# EAGLE design USBSocket_Type3_v1.0 (EAGLE 9.6.2)
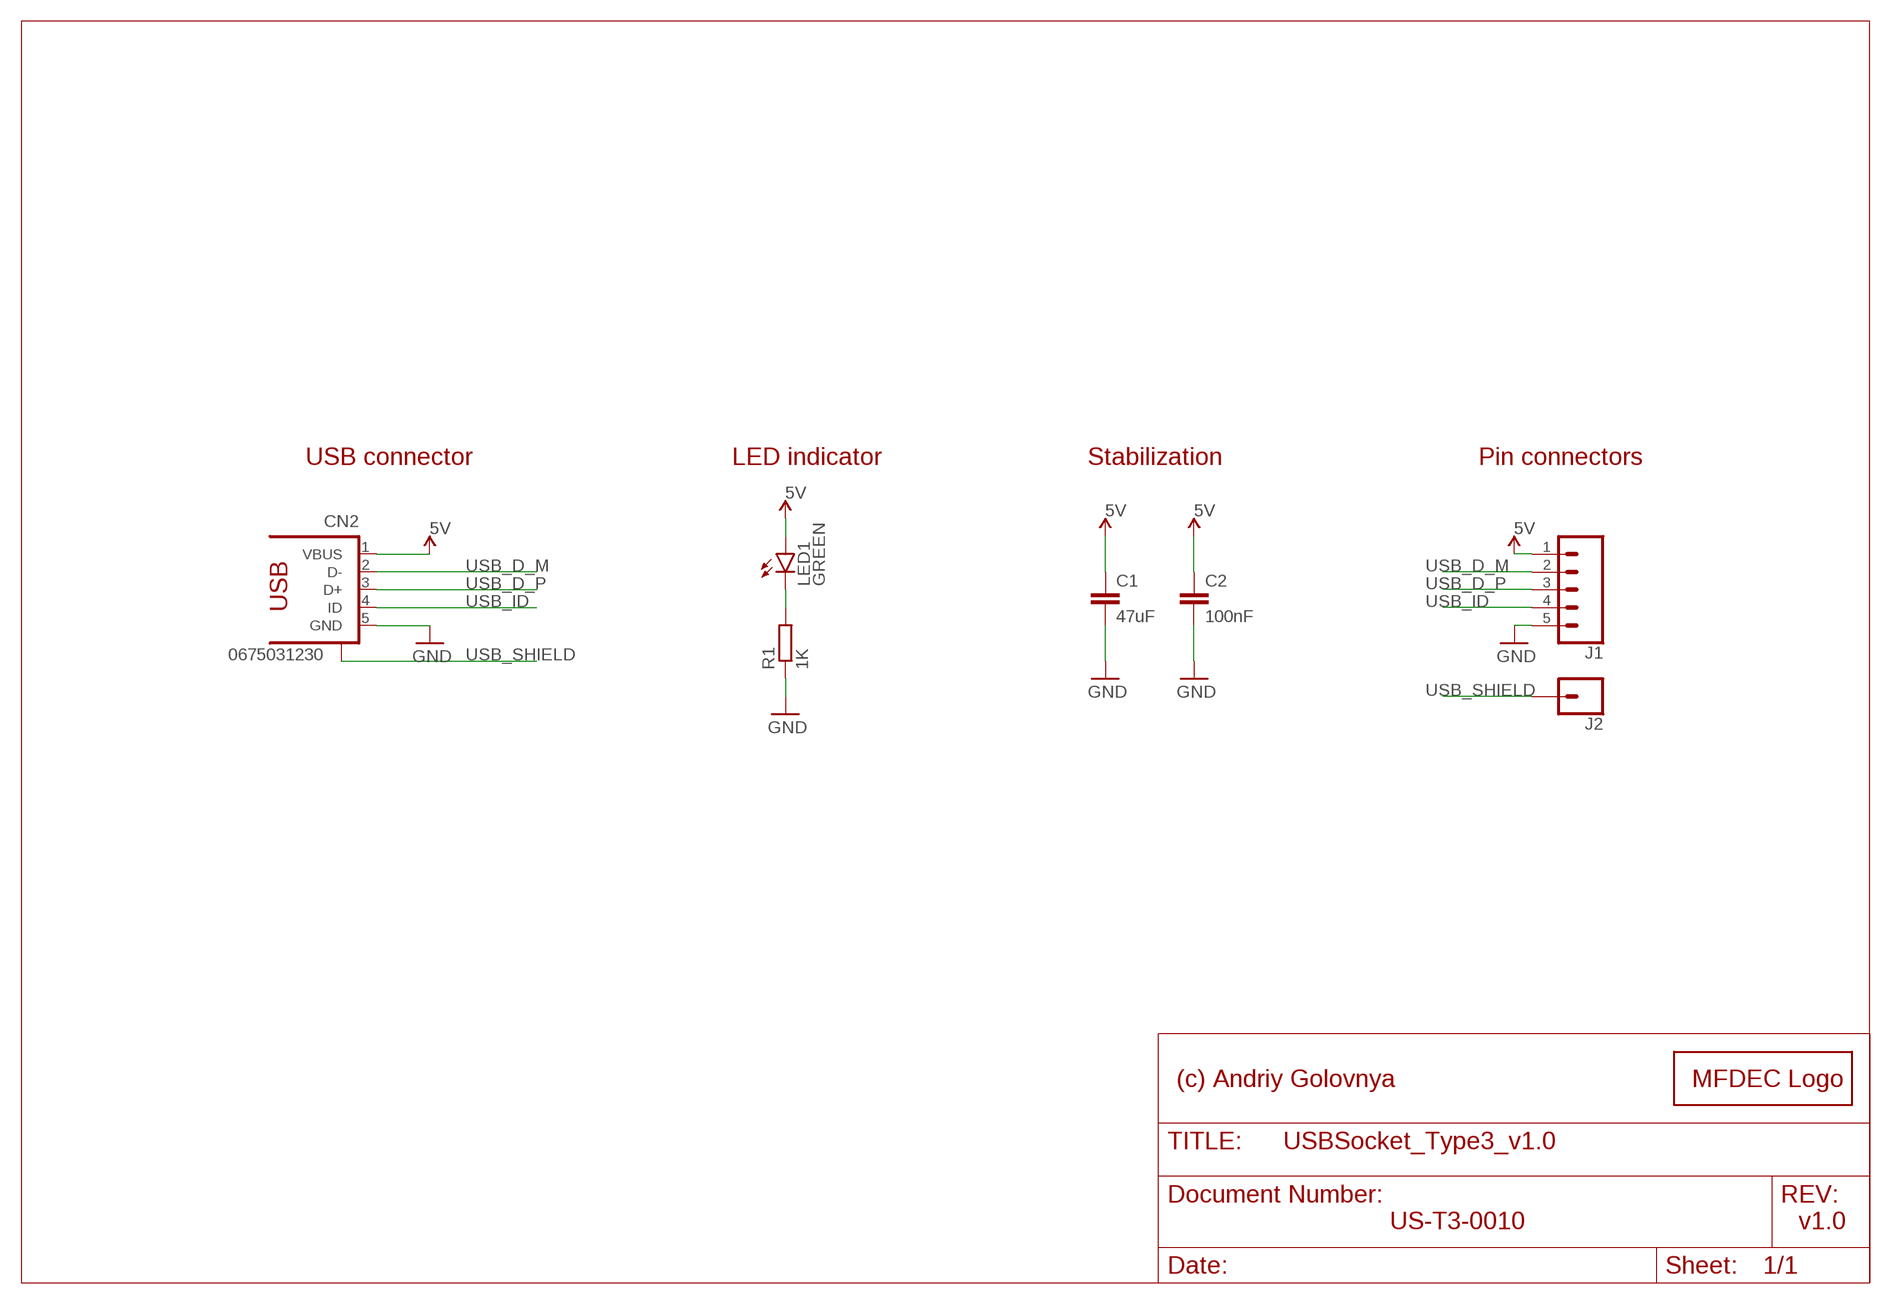
[diagram p0: schematic, sheet 1]

## Parts
C1  47uF  C-EUC0805  [C0805]
C2  100nF  C-EUC0402  [C0402]
CN2  0675031230  PMX42_56579-0576  [PMX42_56579-0576]
J1  CONN_05PTH  [1X05]
J2  CONN_01  [1X01]
LED1  GREEN  LEDSML0603  [SML0603]
LOGO1  MFDECLOGO_L_10MM  [MFDEC_L_10MM]
R1  1K  R-EU_R0402  [R0402]

## Nets
5V [POWER]: C1.1 C2.1 CN2.1(VBUS) J1.1 LED1.A
GND [POWER]: C1.2 C2.2 CN2.5(GND) J1.5 R1.1
N$7: LED1.C R1.2
USB_D_M [XUSB]: CN2.2(D-) J1.2
USB_D_P [XUSB]: CN2.3(D+) J1.3
USB_ID: CN2.4(ID) J1.4
USB_SHIELD: CN2.S1(S) CN2.S2(S) CN2.S3(S) CN2.S4(S) J2.1

## Notes on the sheet
- USB connector | LED indicator | Stabilization | Pin connectors
- (c) Andriy Golovnya
- US-T3-0010 | v1.0

## Library data of the parts
C1 C2 = rcl:C-EU: CAPACITOR, European symbol; SPICEPREFIX: C
CN2 = 52101-101-REV-A_v16:PMX42_56579-0576: USB - OTG, miniUSB Type AB, Molex
J1 = _my_locked_connectors:CONN_05: Multi connection point. Often used as Generic Header-pin footprint for 0.1 inch spaced/style header connections On any of the 0.1 inch spaced packages, you can populate with these: Break Away Headers - Straight <https://www.sparkfun.com/products/116> (PRT-00116) Break Away Male Headers - Right Angle <https://www.sparkfun.com/products/553> (PRT-00553) Female Headers <https://www.sparkfun.com/products/115> (PRT-00115) Break Away Headers - Machine Pin <https://www.sparkfun.com/products/117> (PRT-00117) Break Away Female Headers - Swiss Machine Pin <https://www.sparkfun.com/products/743> (PRT-00743) For SCREWTERMINALS and SPRING TERMINALS visit here: Screw Terimnals on SparkFun.com <https://www.sparkfun.com/search/results?term=Screw+Terminals> (5mm/3.5mm/2.54mm spacing) This device is also useful as a general connection point to wire up your design to another part of your project. Our various solder wires solder well into these plated through hole pads. Hook-Up Wire - Assortment (Stranded, 22 AWG) <https://www.sparkfun.com/products/11375> (PRT-11375) Hook-Up Wire - Assortment (Solid Core, 22 AWG) <https://www.sparkfun.com/products/11367> (PRT-11367) View the entire wire category on our website here <https://www.sparkfun.com/categories/141> Special notes: Molex polarized connector foot print use with SKU : PRT-08231 with associated crimp pins and housings. 1MM SMD Version SKU: PRT-10208
J2 = SparkFun-Connectors:CONN_01: Single connection point. Often used as Generic Header-pin footprint for 0.1 inch spaced/style header connections On any of the 0.1 inch spaced packages, you can populate with these: Break Away Headers - Straight <https://www.sparkfun.com/products/116> (PRT-00116) Break Away Male Headers - Right Angle <https://www.sparkfun.com/products/553> (PRT-00553) Female Headers <https://www.sparkfun.com/products/115> (PRT-00115) Break Away Headers - Machine Pin <https://www.sparkfun.com/products/117> (PRT-00117) Break Away Female Headers - Swiss Machine Pin <https://www.sparkfun.com/products/743> (PRT-00743) This device is also useful as a general connection point to wire up your design to another part of your project. Our various solder wires solder well into these plated through hole pads. Hook-Up Wire - Assortment (Stranded, 22 AWG) <https://www.sparkfun.com/products/11375> (PRT-11375) Hook-Up Wire - Assortment (Solid Core, 22 AWG) <https://www.sparkfun.com/products/11367> (PRT-11367) View the entire wire category on our website here <https://www.sparkfun.com/categories/141> Special notes: SMTSO-256-ET is a "flush mount" nut for a 4-40 screw. We mostly use this on specialty testbeds; it is a nice way to connect hardware to your PCB at an adjustable hieght. Also note, the SNAP packages are for using a snappable style connector. We sell a baggie of snaps and they are also used on two LilyPad designs: Snap Assortment - 30 pack (male and female) <https://www.sparkfun.com/products/11347> (DEV-11347) LilyPad Arduino SimpleSnap <https://www.sparkfun.com/products/10941> (DEV-10941) LilyPad SimpleSnap Protoboard <https://www.sparkfun.com/products/10940> (DEV-10940)
LED1 = led:LED: LED OSRAM: - CHIPLED LG R971, LG N971, LY N971, LG Q971, LY Q971, LO R971, LY R971 LH N974, LH R974 LS Q976, LO Q976, LY Q976 LO Q996 - Hyper CHIPLED LW Q18S LB Q993, LB Q99A, LB R99A - SideLED LS A670, LO A670, LY A670, LG A670, LP A670 LB A673, LV A673, LT A673, LW A673 LH A674 LY A675 LS A676, LA A676, LO A676, LY A676, LW A676 LS A679, LY A679, LG A679 - Hyper Micro SIDELED® LS Y876, LA Y876, LO Y876, LY Y876 LT Y87S - SmartLED LW L88C, LW L88S LB L89C, LB L89S, LG L890 LS L89K, LO L89K, LY L89K LS L896, LA L896, LO L896, LY L896 - TOPLED LS T670, LO T670, LY T670, LG T670, LP T670 LSG T670, LSP T670, LSY T670, LOP T670, LYG T670 LG T671, LOG T671, LSG T671 LB T673, LV T673, LT T673, LW T673 LH T674 LS T676, LA T676, LO T676, LY T676, LB T676, LH T676, LSB T676, LW T676 LB T67C, LV T67C, LT T67C, LS T67K, LO T67K, LY T67K, LW E67C LS E67B, LA E67B, LO E67B, LY E67B, LB E67C, LV E67C, LT E67C LW T67C LS T679, LY T679, LG T679 LS T770, LO T770, LY T770, LG T770, LP T770 LB T773, LV T773, LT T773, LW T773 LH T774 LS E675, LA E675, LY E675, LS T675 LS T776, LA T776, LO T776, LY T776, LB T776 LHGB T686 LT T68C, LB T68C - Hyper Mini TOPLED® LB M676 - Mini TOPLED Santana® LG M470 LS M47K, LO M47K, LY M47K Source: http://www.osram.convergy.de LUXEON: - LUMILED® LXK2-PW12-R00, LXK2-PW12-S00, LXK2-PW14-U00, LXK2-PW14-V00 LXK2-PM12-R00, LXK2-PM12-S00, LXK2-PM14-U00 LXK2-PE12-Q00, LXK2-PE12-R00, LXK2-PE12-S00, LXK2-PE14-T00, LXK2-PE14-U00 LXK2-PB12-K00, LXK2-PB12-L00, LXK2-PB12-M00, LXK2-PB14-N00, LXK2-PB14-P00, LXK2-PB14-Q00 LXK2-PR12-L00, LXK2-PR12-M00, LXK2-PR14-Q00, LXK2-PR14-R00 LXK2-PD12-Q00, LXK2-PD12-R00, LXK2-PD12-S00 LXK2-PH12-R00, LXK2-PH12-S00 LXK2-PL12-P00, LXK2-PL12-Q00, LXK2-PL12-R00 Source: www.luxeon.com KINGBRIGHT: KA-3528ASYC Source: www.kingbright.com
LOGO1 = _my_logos:MFDECLOGO: Midnight Fog - Digital Eye Candy LOGO
R1 = rcl:R-EU_: RESISTOR, European symbol; SPICEPREFIX: R

## Net classes
1 XUSB: width 0.305 mm
2 USB: width 0.305 mm
3 POWER: width 0.305 mm

## Board
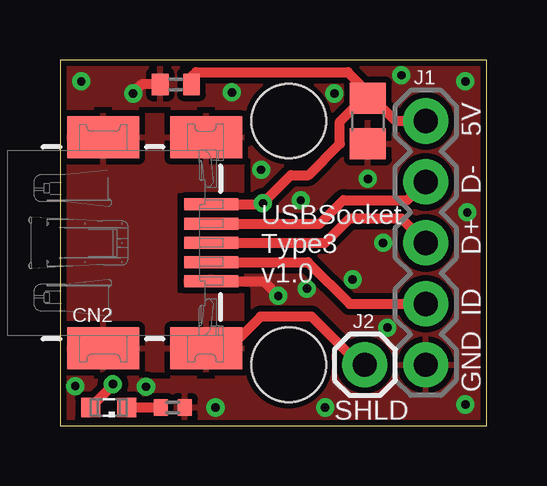
[diagram p1: board, top side]
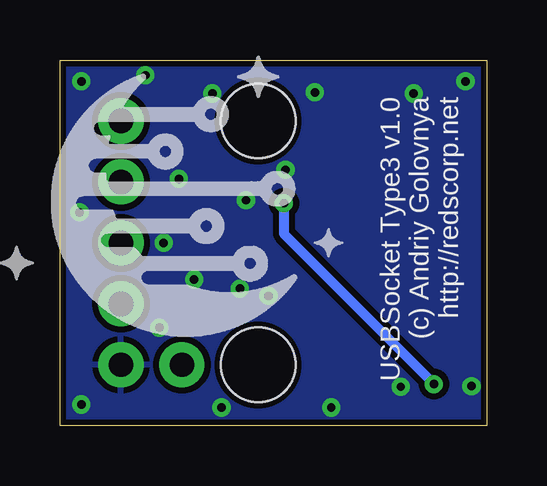
[diagram p2: board, bottom side, seen from below]

Size 17.78 x 15.24 mm. Coordinates in mm from the lower left corner, seen from the top.
Outline: 0,0 17.78,0 17.78,15.24 0,15.24 0,0
Copper layers (1*16): Top 0.035mm / dielectric 1.5mm / Bottom 0.035mm
Design rules "default *": minimum track width 6mil, minimum drill 0.35mm, track to track 6mil, track to pad 6mil, pad to pad 6mil, via to via 6mil, smd to smd 6mil, copper to edge 10mil, drill to drill 6mil, minimum pad ring 10mil, minimum via ring 8mil, stop-mask expansion 4mil, vias tented up to drill 20mil, thermal gap 10mil
Holes 3.1 mm at 9.53,2.54 9.53,12.7

### Footprints (pad centres in the part's own frame; a part is rotated, then mirrored left to right if it is on the bottom)
C0805 = smd 1.3 x 1.5: 1 -0.95,0; 2 0.95,0
C0402 = smd 0.7 x 0.9: 1 -0.65,0; 2 0.65,0
PMX42_56579-0576 = smd 0.5 x 2.25: 1 1.6,-0.2; 2 0.8,-0.2; 3 0,-0.2; 4 -0.8,-0.2; 5 -1.6,-0.2 | smd 1.75 x 3: S1 -4.4,0; S2 4.4,0; S3 -4.4,4.3; S4 4.4,4.3
1X05 = drill 1.016 pad 1.88: 1 0,0; 2 2.54,0; 3 5.08,0; 4 7.62,0; 5 10.16,0
1X01 = drill 1.016 pad 1.88: 1 0,0
SML0603 = smd 0.8 x 0.8: A 0.75,0; C -0.75,0
R0402 = smd 0.6 x 0.7: 1 -0.5,0; 2 0.5,0

### Placement (x,y rotation side)
C1  12.83,12.7 270 top
C2  4.83,14.22 180 top
CN2  6.1,7.62 90 top
J1  15.24,12.7 270 top
J2  12.7,2.54 0 top
LED1  2.03,0.76 180 top
LOGO1  21.08,2.79 0 bottom  (outside the outline)
R1  4.7,0.76 180 top

### Tracks (layer width: path | path; a pad name or v marks a point on that pad's centre or on a via)
5V  (via drill 0.35)
  Top 0.406: C1.1 12.63,13.65 11.66,12.68 11.66,11.74 10.36,10.44 9.62,10.44 v8.45,9.27 8.4,9.22 CN2.1 | C2.1 5.48,14.54 5.67,14.73 12,14.73 12.83,13.9 C1.1 | C1.1 13.02,13.65 13.97,12.7 J1.1 | v2.2,1.73 2.2,1.68 LED1.A
  Bottom 0.406: v2.2,1.73 2.2,1.75 8.45,8 v8.45,9.27
GND  (via drill 0.35)
  Top 0.406: C2.2 3.41,14.22 3.04,13.86 v3.04,13.84 | CN2.5 8.48,6.02 v9.09,5.41
  other vias: 13.64,4.09 6.48,0.76 16.89,0.89 16.89,14.35 16.97,8.89 10.03,9.4 12.83,10.29 7.16,13.89 8.38,10.67 11.43,13.84 11.05,0.76 14.22,14.61 12.19,6.1 13.46,7.62 3.58,1.63 10.29,5.71 0.89,14.35 0.64,1.65
  pour Top (isolate 0.254, rank 2): 0,0 23.88,0 23.88,15.24 0,15.24
  pour Bottom (isolate 0.254, rank 2): 0,0 20.7,0 20.7,15.24 0,15.24
N$7
  Top 0.406: LED1.C R1.2
USB_D_M
  Top 0.406: J1.2 14.48,9.4 11.81,9.4 10.83,8.42 CN2.2
USB_D_P
  Top 0.406: J1.3 14.22,8.64 12.06,8.64 11.05,7.62 CN2.3
USB_ID
  Top 0.406: J1.4 12.06,5.08 10.32,6.82 CN2.4
USB_SHIELD
  Top 0.406: J2.1 12.49,2.54 10.48,4.55 8.36,4.55 6.99,3.17
  pour Top (isolate 0.254): 4.83,9.78 7.62,9.78 7.62,12.95 0,12.95 0,2.29 7.62,2.29 7.62,5.46 4.83,5.46

### Text on the board
tPlace: 5V | D- | D+ | USBSocket / Type3 / v1.0 | ID | GND | SHLD
bPlace: USBSocket Type3 v1.0 / (c) Andriy Golovnya / http://redscorp.net